# Altium schematic sheet LTM8051.SchDoc
size A4; SheetNumber: 1; SheetTotal: 1
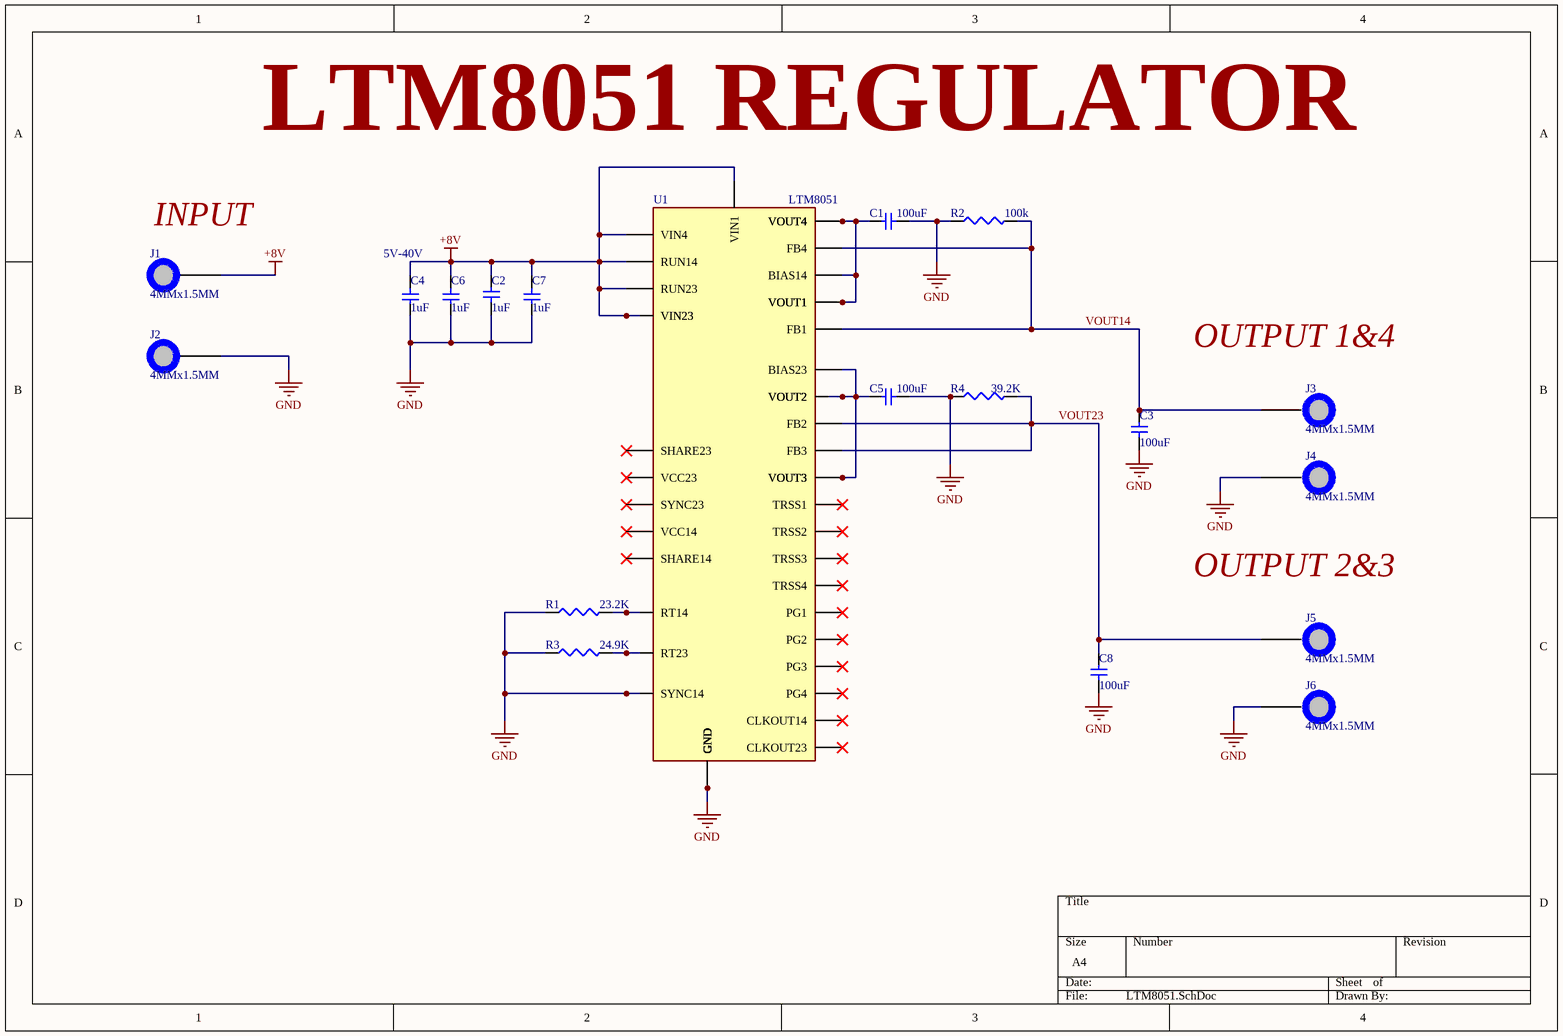
[diagram p0: LTM8051.SchDoc]

## Parts
C1  100uF  [C0805]
C2  1uF  [C0805]
C3  100uF  [C0805]
C4  1uF  [C0805]
C5  100uF  [C0805]
C6  1uF  [C0805]
C7  1uF  [C0805]
C8  100uF  [C0805]
J1  4MMx1.5MM  [PAD_WITH_HOLE_4MMx1MM5]
J2  4MMx1.5MM  [PAD_WITH_HOLE_4MMx1MM5]
J3  4MMx1.5MM  [PAD_WITH_HOLE_4MMx1MM5]
J4  4MMx1.5MM  [PAD_WITH_HOLE_4MMx1MM5]
J5  4MMx1.5MM  [PAD_WITH_HOLE_4MMx1MM5]
J6  4MMx1.5MM  [PAD_WITH_HOLE_4MMx1MM5]
R1  23.2K  [R0805]
R2  100k  [R0805]
R3  24.9K  [R0805]
R4  39.2K  [R0805]
U1  LTM8051  [BGA91C80P7X13_625X1125X241]

## Nets
+8V: C2.2 C4.1 C6.1 C7.1 J1.1 U1.C7(RUN23) U1.D7(RUN14) U1.E7(VIN1) U1.F7(VIN4) U1.G1(VIN23) U1.H1(VIN23)
GND: C1.1 C2.1 C3.1 C4.2 C5.1 C6.2 C7.2 C8.1 J2.1 J4.1 J6.1 R1.1 R2.1 R3.1 R4.1 U1.B3(GND) U1.B4(GND) U1.B5(GND) U1.C3(GND) U1.C4(GND) U1.C5(GND) U1.D3(GND) U1.D4(GND) U1.D5(GND) U1.E1(GND) U1.E2(GND) U1.E3(GND) U1.E4(GND) U1.E5(GND) U1.F1(GND) U1.F2(GND) U1.F3(GND) U1.F4(GND) U1.F5(GND) U1.F6(SYNC14) U1.G2(GND) U1.G3(GND_21) U1.G4(GND) U1.G5(GND) U1.G6(GND) U1.G7(GND) U1.H2(GND) U1.H3(GND) U1.H4(GND) U1.H5(GND) U1.H6(GND) U1.H7(GND) U1.J3(GND) U1.J4(GND) U1.J5(GND) U1.J6(GND) U1.J7(GND) U1.K3(GND) U1.K4(GND) U1.K5(GND) U1.L3(GND) U1.L4(GND) U1.L5(GND) U1.M3(GND) U1.M4(GND) U1.M5(GND)
VOUT14: C3.2 J3.1 R2.2 U1.L1(FB4) U1.L2(FB1)
VOUT23: C8.2 J5.1 R4.2 U1.D1(FB3) U1.D2(FB2)
NetC1_2: C1.2 U1.M1(VOUT1) U1.M2(VOUT1) U1.M6(VOUT4) U1.M7(VOUT4) U1.N1(VOUT1) U1.N2(VOUT1) U1.N3(BIAS14) U1.N6(VOUT4) U1.N7(VOUT4)
NetC5_2: C5.2 U1.A1(VOUT3) U1.A2(VOUT3) U1.A5(BIAS23) U1.A6(VOUT2) U1.A7(VOUT2) U1.B1(VOUT3) U1.B2(VOUT3) U1.B6(VOUT2) U1.B7(VOUT2)
NetR1_2: R1.2 U1.K1(RT14)
NetR3_2: R3.2 U1.J1(RT23)

Not connected (* = marked no-connect by the designer): U1 A3(SHARE23)* A4(VCC23)* C1(TRSS3)* C2(TRSS2)* C6(CLKOUT23)* D6(CLKOUT14)* E6(SYNC23)* J2(TRSS1)* K2(TRSS4)* K6(PG2)* K7(PG3)* L6(PG1)* L7(PG4)* N4(VCC14)* N5(SHARE14)*

## Notes on the sheet
- LTM8051 REGULATOR
- (near J1) INPUT
- 5V-40V
- OUTPUT 1&4
- OUTPUT 2&3

## Library data of the parts
C1 C3 C5 C8 = CM21X5R107M06AT: 100UF 6.3V 20% 0805; Manufacturer: Kyocera AVX; Supplier: Digi-Key; Supplier Part Number: 478-CM21X5R107M06ATCT-ND; Manufacturer Part Number: CM21X5R107M06AT; RoHS: No; Category: Uncategorized; Stock: 7994; Pricing: 1=1,2, 10=0,95, 50=0,8236, 100=0,7128, 500=0,53856, 1000=0,4752 (USD)
C2 C4 C6 C7 = C2012X5R1H105M085AB: Cap Ceramic 1uF 50V X5R 20% SMD 0805 85°C Punched Paper T/R; Manufacturer: TDK; Supplier: Digi-Key; Supplier Part Number: 445-14402-1-ND; Manufacturer Part Number: C2012X5R1H105M085AB; RoHS: Yes; Category: Ceramic Capacitors; Stock: 11936; Pricing: 1=0,24, 10=0,164, 50=0,1094, 100=0,0931, 500=0,0657, 1000=0,05748 (USD); Mounting Technology: Surface Mount; Case/Package: 0805; Case Code (Metric): 2012; Case Code (Imperial): 0805; Weight: 0.000194oz; Dielectric Material: Ceramic; Min Operating Temperature: -55°C; Max Operating Temperature: 85°C; Package Quantity: 4000; Packaging: Tape and Reel; Value: 1uF; Tolerance: 20%; Voltage Rating: 50V; Dielectric: X5R; Termination: SMD/SMT; Voltage Rating (DC): 50V; Series: C; Length: 0.079inch; Width: 0.049inch; Height: 0.85mm; Thickness: 0.039inch; Lead Free: Lead Free; RoHS Compliant: Yes; ComponentLink1URL: https://datasheet.ciiva.com/14896/tdkmlcccaprange-14896957.pdf?src-supplier=Digi-Key; ComponentLink1Description: https://datasheet.ciiva.com/14896/tdkmlcccaprange-14896957.pdf?src-supplier=Digi-Key; ComponentLink2URL: https://datasheet.ciiva.com/14896/tdkmlcccaprange-14896958.pdf?src-supplier=Digi-Key; ComponentLink2Description: https://datasheet.ciiva.com/14896/tdkmlcccaprange-14896958.pdf?src-supplier=Digi-Key; ComponentLink3URL: https://datasheet.ciiva.com/14896/tdkmlcccaprange-14896959.pdf?src-supplier=Digi-Key; ComponentLink3Description: https://datasheet.ciiva.com/14896/tdkmlcccaprange-14896959.pdf?src-supplier=Digi-Key
J1-J6 = PAD_WITH_HOLE_4MMx1MM5: Pad with a hole 4mmx1.5mm
R1 = ERJ-6ENF2322V: Res Thick Film 0805 23.2K Ohm 1% 1/8W |100ppm/|C SMD Punched Carrier T/R; Manufacturer: Panasonic; Value: 23.2kR; Power Rating: 125mW; Voltage Rating: 150V; Temperature Coefficient: 100ppm/°C; Supplier: Mouser; Supplier Part Number: 667-ERJ-6ENF2322V; Manufacturer Part Number: ERJ-6ENF2322V; RoHS: Yes; Category: Chip SMD Resistors; Stock: 39678; Pricing: 1=0,1, 10=0,047, 50=0,047, 100=0,021, 1000=0,015, 10000=0,01 (USD); Mounting Technology: Surface Mount; Case/Package: 0805; Case Code (Metric): 2012; Case Code (Imperial): 0805; Contact Plating: Tin; Min Operating Temperature: -55°C; Max Operating Temperature: 155°C; Tolerance: 1%; Packaging: Tape and Reel; Package Quantity: 1; Resistor Type: Thick Film; Number of Terminations: 2; Termination: SMD/SMT; Max Power Dissipation: 125mW; Voltage Rating (DC): 150V; Features: Automotive AEC-Q200; Series: ERJ; Resistance Tolerance: 1%; Technology: THICK FILM; Length: 2mm; Width: 1.2mm; Height: 0.6mm; Depth: 1.25mm; Reach SVHC Compliant: Yes; Lead Free: Lead Free; RoHS Compliant: Yes; ComponentLink1URL: https://datasheet.ciiva.com/30086/aoa0000ce2-30086557.pdf?src-supplier=Onlinecomponents.com; ComponentLink1Description: https://datasheet.ciiva.com/30086/aoa0000ce2-30086557.pdf?src-supplier=Onlinecomponents.com; ComponentLink2URL: https://datasheet.ciiva.com/15829/aoa0000ce2-15829836.pdf?src-supplier=Onlinecomponents.com; ComponentLink2Description: https://datasheet.ciiva.com/15829/aoa0000ce2-15829836.pdf?src-supplier=Onlinecomponents.com; ComponentLink3URL: https://datasheet.ciiva.com/7870/aoa0000ce2-7870831.pdf?src-supplier=Element14; ComponentLink3Description: https://datasheet.ciiva.com/7870/aoa0000ce2-7870831.pdf?src-supplier=Element14; ComponentLink4URL: https://datasheet.ciiva.com/16770/70260748-16770232.pdf?src-supplier=Allied+Electronics; ComponentLink4Description: https://datasheet.ciiva.com/16770/70260748-16770232.pdf?src-supplier=Allied+Electronics; ComponentLink5URL: https://datasheet.ciiva.com/16766/70260748-16766008.pdf?src-supplier=Allied+Electronics; ComponentLink5Description: https://datasheet.ciiva.com/16766/70260748-16766008.pdf?src-supplier=Allied+Electronics; ComponentLink6URL: https://datasheet.ciiva.com/28548/1694929-28548334.pdf?src-supplier=Element14; ComponentLink6Description: https://datasheet.ciiva.com/28548/1694929-28548334.pdf?src-supplier=Element14; ComponentLink7URL: https://datasheet.ciiva.com/24026/aoa0000ce2-24026235.pdf?src-supplier=Mouser; ComponentLink7Description: https://datasheet.ciiva.com/24026/aoa0000ce2-24026235.pdf?src-supplier=Mouser
R2 = ERA-6AEB104V: Res Thin Film 0805 100K Ohm 0.1% 1/8W ±25ppm/°C Molded SMD SMD Punched Carrier T/R; Manufacturer: Panasonic; Supplier: Digi-Key; Supplier Part Number: P100KDACT-ND; Manufacturer Part Number: ERA-6AEB104V; RoHS: Yes; Category: Chip SMD Resistors; Stock: 191439; Pricing: 1=0,31, 10=0,264, 50=0,1394, 100=0,1034, 500=0,0625, 1000=0,04327 (USD); ComponentLink1URL: https://datasheet.ciiva.com/11811/0900766b80beefcc-11811258.pdf?src-supplier=Rs; ComponentLink1Description: https://datasheet.ciiva.com/11811/0900766b80beefcc-11811258.pdf?src-supplier=Rs; ComponentLink2URL: https://datasheet.ciiva.com/26335/453651-da-01-en-widerstand-0805-era-26335725.pdf?src-supplier=Conrad; ComponentLink2Description: https://datasheet.ciiva.com/26335/453651-da-01-en-widerstand-0805-era-26335725.pdf?src-supplier=Conrad; ComponentLink3URL: https://datasheet.ciiva.com/22758/485442-22758153.pdf?src-supplier=Farnell; ComponentLink3Description: https://datasheet.ciiva.com/22758/485442-22758153.pdf?src-supplier=Farnell; ComponentLink4URL: https://datasheet.ciiva.com/22758/485442-22758155.pdf?src-supplier=Farnell; ComponentLink4Description: https://datasheet.ciiva.com/22758/485442-22758155.pdf?src-supplier=Farnell; ComponentLink5URL: https://datasheet.ciiva.com/43457/485442-43457791.pdf?src-supplier=Farnell; ComponentLink5Description: https://datasheet.ciiva.com/43457/485442-43457791.pdf?src-supplier=Farnell; ComponentLink6URL: https://datasheet.ciiva.com/16396/aoa0000ce26-16396829.pdf?src-supplier=Future+Electronics; ComponentLink6Description: https://datasheet.ciiva.com/16396/aoa0000ce26-16396829.pdf?src-supplier=Future+Electronics; ComponentLink7URL: https://datasheet.ciiva.com/9186/aoa0000ce26-9186703.pdf?src-supplier=Avnet; ComponentLink7Description: https://datasheet.ciiva.com/9186/aoa0000ce26-9186703.pdf?src-supplier=Avnet; ComponentLink8URL: https://datasheet.ciiva.com/46438/485442-46438215.pdf?src-supplier=Element14; ComponentLink8Description: https://datasheet.ciiva.com/46438/485442-46438215.pdf?src-supplier=Element14; ComponentLink9URL: https://datasheet.ciiva.com/46438/485442-46438216.pdf?src-supplier=Element14; ComponentLink9Description: https://datasheet.ciiva.com/46438/485442-46438216.pdf?src-supplier=Element14; ComponentLink10URL: https://datasheet.ciiva.com/46438/485442-46438217.pdf?src-supplier=Element14; ComponentLink10Description: https://datasheet.ciiva.com/46438/485442-46438217.pdf?src-supplier=Element14; ComponentLink11URL: https://datasheet.ciiva.com/16768/70068849-16768795.pdf?src-supplier=Allied+Electronics; ComponentLink11Description: https://datasheet.ciiva.com/16768/70068849-16768795.pdf?src-supplier=Allied+Electronics; ComponentLink12URL: https://datasheet.ciiva.com/16763/70068849-16763132.pdf?src-supplier=Allied+Electronics; ComponentLink12Description: https://datasheet.ciiva.com/16763/70068849-16763132.pdf?src-supplier=Allied+Electronics; ComponentLink13URL: https://datasheet.ciiva.com/48425/era-eng-tds-48425749.pdf?src-supplier=Distrelec; ComponentLink13Description: https://datasheet.ciiva.com/48425/era-eng-tds-48425749.pdf?src-supplier=Distrelec; ComponentLink14URL: https://datasheet.ciiva.com/48529/era-eng-tds-48529996.pdf?src-supplier=Distrelec; ComponentLink14Description: https://datasheet.ciiva.com/48529/era-eng-tds-48529996.pdf?src-supplier=Distrelec
R3 = AC0805FR-0724K9L: SMD Chip Resistor, 24.9 kOhm, ± 1%, 125 mW, 0805 [2012 Metric], Thick Film, General Purpose; Manufacturer: Yageo; Power Rating: 125mW; Value: 24.9kR; Voltage Rating: 150V; Temperature Coefficient: 100ppm/°C; Supplier: Digi-Key; Supplier Part Number: 13-AC0805FR-0724K9LCT-ND; Manufacturer Part Number: AC0805FR-0724K9L; RoHS: Yes; Category: Chip SMD Resistors; Stock: 35788; Pricing: 1=0,1, 10=0,029, 50=0,0188, 100=0,0158, 500=0,01096, 1000=0,00948 (USD); Case/Package: 0805; Case Code (Imperial): 0805; Case Code (Metric): 2012; Min Operating Temperature: -55°C; Max Operating Temperature: 155°C; Packaging: Tape and Reel; Tolerance: 1%; Number of Terminations: 2; Termination: SMD/SMT; Max Power Dissipation: 125mW; Features: Moisture Resistant,Automotive AEC-Q200; Series: AC; Length: 0.079inch; Width: 1.25mm; Height: 0.024inch; RoHS Compliant: Yes; ComponentLink1URL: http://www.mouser.com/ds/2/447/yageodocoutput-1111992.pdf?src-supplier=Mouser; ComponentLink1Description: http://www.mouser.com/ds/2/447/yageodocoutput-1111992.pdf?src-supplier=Mouser; ComponentLink2URL: http://www.yageo.com/NewPortal/yageodocoutput?fileName=/pdf/R-Chip/PYu-AC_51_RoHS_L_6.pdf&src-supplier=Digi-Key; ComponentLink2Description: http://www.yageo.com/NewPortal/yageodocoutput?fileName=/pdf/R-Chip/PYu-AC_51_RoHS_L_6.pdf&src-supplier=Digi-Key
R4 = ERJ-6ENF3922V: Res Thick Film 0805 39.2K Ohm 1% 1/8W ±100ppm/°C Molded SMD Punched Carrier T/R; Manufacturer: Panasonic; Supplier: Digi-Key; Supplier Part Number: P39.2KCCT-ND; Manufacturer Part Number: ERJ-6ENF3922V; RoHS: Yes; Category: Chip SMD Resistors; Stock: 54485; Pricing: 1=0,1, 10=0,079, 50=0,0424, 100=0,0303, 500=0,01878, 1000=0,01333 (USD); ComponentLink1URL: https://datasheet.ciiva.com/15159/getdatasheetpartid-29130-15159258.pdf?src-supplier=Verical; ComponentLink1Description: https://datasheet.ciiva.com/15159/getdatasheetpartid-29130-15159258.pdf?src-supplier=Verical; ComponentLink2URL: https://datasheet.ciiva.com/9189/aoa0000ce2-9189961.pdf?src-supplier=Avnet; ComponentLink2Description: https://datasheet.ciiva.com/9189/aoa0000ce2-9189961.pdf?src-supplier=Avnet
U1 = LTM8051EY#PBF: Switching Regulator, Current-mode, 2.5A, 3000kHz Switching Freq-Max, Hybrid, PBGA91; Manufacturer: Analog Devices; Supplier: Digi-Key; Supplier Part Number: 505-LTM8051EY#PBF-ND; Manufacturer Part Number: LTM8051EY#PBF; RoHS: No; Category: Board Mount Modules; Stock: 1085; Pricing: 1=20,72, 10=19,111, 25=18,2516, 80=16,31913, 273=15,56762, 546=14,8161 (USD)